# EAGLE schematic NusbioMCU (EAGLE 7.6.0)
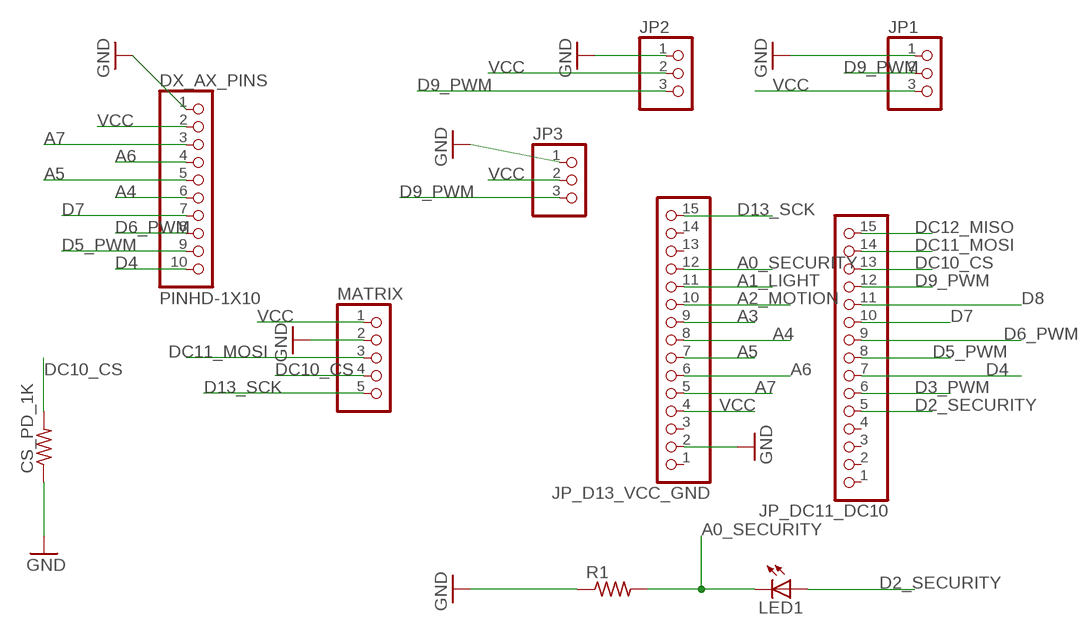
[diagram p0: schematic, sheet 1]

## Parts
CS_PD_1K  R-US_R0805  [R0805]
DX_AX_PINS  PINHD-1X10  [1X10-BIG]
JP1  PINHD-1X3  [1X03]
JP2  PINHD-1X3  [1X03]
JP3  PINHD-1X3  [1X03]
JP_D13_VCC_GND  PINHD-1X15  [1X15]
JP_DC11_DC10  PINHD-1X15  [1X15]
LED1  LEDCHIPLED_0805  [CHIPLED_0805]
MATRIX  PINHD-1X5  [1X05]
R1  R-US_R0805  [R0805]

## Nets
A0_SECURITY: JP_D13_VCC_GND.12 LED1.C R1.2
A1_LIGHT: JP_D13_VCC_GND.11
A2_MOTION: JP_D13_VCC_GND.10
A3: JP_D13_VCC_GND.9
A4: DX_AX_PINS.6 JP_D13_VCC_GND.8
A5: DX_AX_PINS.5 JP_D13_VCC_GND.7
A6: DX_AX_PINS.4 JP_D13_VCC_GND.6
A7: DX_AX_PINS.3 JP_D13_VCC_GND.5
D2_SECURITY: JP_DC11_DC10.5 LED1.A
D3_PWM: JP_DC11_DC10.6
D4: DX_AX_PINS.10 JP_DC11_DC10.7
D5_PWM: DX_AX_PINS.9 JP_DC11_DC10.8
D6_PWM: DX_AX_PINS.8 JP_DC11_DC10.9
D7: DX_AX_PINS.7 JP_DC11_DC10.10
D8: JP_DC11_DC10.11
D9_PWM: JP1.2 JP2.3 JP3.3 JP_DC11_DC10.12
D13_SCK: JP_D13_VCC_GND.15 MATRIX.5
DC10_CS: CS_PD_1K.2 JP_DC11_DC10.13 MATRIX.4
DC11_MOSI: JP_DC11_DC10.14 MATRIX.3
DC12_MISO: JP_DC11_DC10.15
GND: CS_PD_1K.1 DX_AX_PINS.1 JP1.1 JP2.1 JP3.1 JP_D13_VCC_GND.2 MATRIX.2 R1.1
VCC: DX_AX_PINS.2 JP1.3 JP2.2 JP3.2 JP_D13_VCC_GND.4 MATRIX.1
Unconnected: JP_D13_VCC_GND.1 JP_D13_VCC_GND.3 JP_D13_VCC_GND.13 JP_D13_VCC_GND.14 JP_DC11_DC10.1 JP_DC11_DC10.2 JP_DC11_DC10.3 JP_DC11_DC10.4

## Library data of the parts
CS_PD_1K R1 = adafruit:R-US_: RESISTOR, American symbol
DX_AX_PINS = adafruit:PINHD-1X10: Pin header 1x10 0.1" spacing With round pins
JP1-JP3 = adafruit:PINHD-1X3: PIN HEADER
JP_D13_VCC_GND JP_DC11_DC10 = adafruit:PINHD-1X15: PIN HEADER
LED1 = adafruit:LED: LED OSRAM: - CHIPLED LG R971, LG N971, LY N971, LG Q971, LY Q971, LO R971, LY R971 LH N974, LH R974 LS Q976, LO Q976, LY Q976 LO Q996 - Hyper CHIPLED LW Q18S LB Q993, LB Q99A, LB R99A - SideLED LS A670, LO A670, LY A670, LG A670, LP A670 LB A673, LV A673, LT A673, LW A673 LH A674 LY A675 LS A676, LA A676, LO A676, LY A676, LW A676 LS A679, LY A679, LG A679 - Hyper Micro SIDELED® LS Y876, LA Y876, LO Y876, LY Y876 LT Y87S - SmartLED LW L88C, LW L88S LB L89C, LB L89S, LG L890 LS L89K, LO L89K, LY L89K LS L896, LA L896, LO L896, LY L896 - TOPLED LS T670, LO T670, LY T670, LG T670, LP T670 LSG T670, LSP T670, LSY T670, LOP T670, LYG T670 LG T671, LOG T671, LSG T671 LB T673, LV T673, LT T673, LW T673 LH T674 LS T676, LA T676, LO T676, LY T676, LB T676, LH T676, LSB T676, LW T676 LB T67C, LV T67C, LT T67C, LS T67K, LO T67K, LY T67K, LW E67C LS E67B, LA E67B, LO E67B, LY E67B, LB E67C, LV E67C, LT E67C LW T67C LS T679, LY T679, LG T679 LS T770, LO T770, LY T770, LG T770, LP T770 LB T773, LV T773, LT T773, LW T773 LH T774 LS E675, LA E675, LY E675, LS T675 LS T776, LA T776, LO T776, LY T776, LB T776 LHGB T686 LT T68C, LB T68C - Hyper Mini TOPLED® LB M676 - Mini TOPLED Santana® LG M470 LS M47K, LO M47K, LY M47K Source: http://www.osram.convergy.de/
MATRIX = pinhead:PINHD-1X5: PIN HEADER